# Altium schematic sheet 2_ADSTM32_MCU.SchDoc
size A4; SheetNumber: 3; SheetTotal: 4
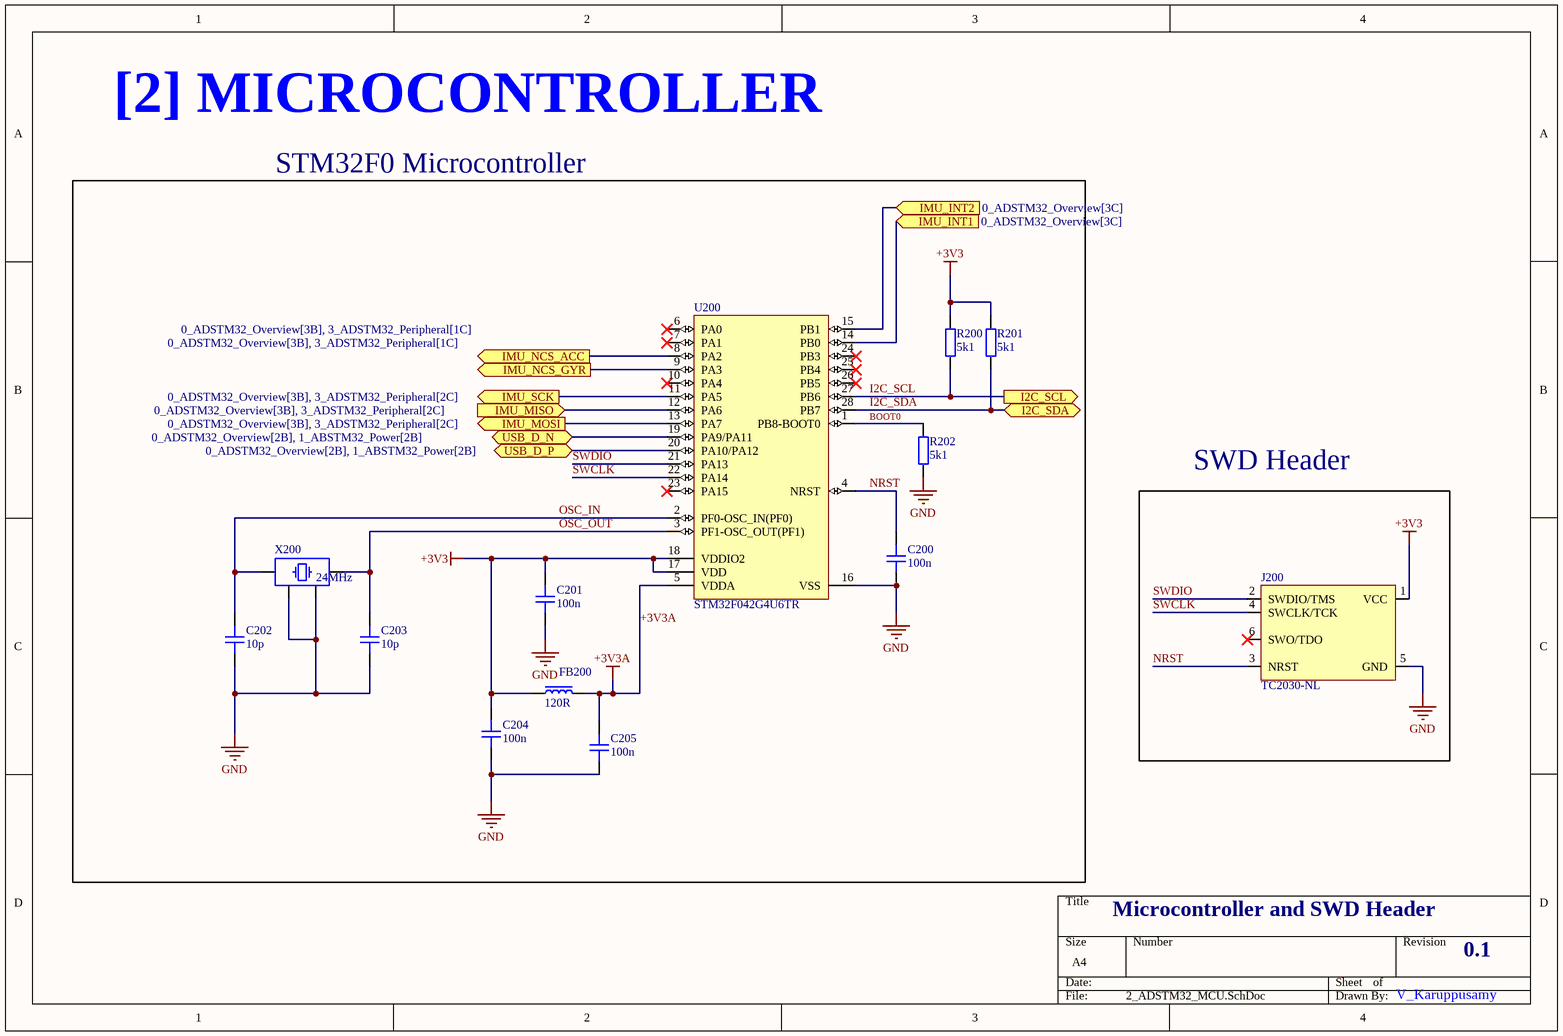
[diagram p0: 2_ADSTM32_MCU.SchDoc]

## Parts
C200  100n  [CAP_0805]
C201  100n  [CAP_0805]
C202  10p  [CAP_0805]
C203  10p  [CAP_0805]
C204  100n  [CAP_0805]
C205  100n  [CAP_0805]
FB200  120R  [FB_0402]
J200  TC2030-NL  [TC2030-NL-FP]  (no BOM)
R200  5k1  [RES_0603]
R201  5k1  [RES_0603]
R202  5k1  [RES_0603]
U200  STM32F042G4U6TR  [STM-UFQFPN28_V]
X200  24MHz  [XTAL_3225]

## Blocks framed on the sheet
STM32F0 Microcontroller: C200-C205 FB200 R200-R202 U200 X200
SWD Header: J200

## Ports
I2C_SCL (out), I2C_SDA (bidir), IMU_INT1 (in, see 0_ADSTM32_Overview[3C]), IMU_INT2 (in, see 0_ADSTM32_Overview[3C]), IMU_MISO (in, see 0_ADSTM32_Overview[3B], 3_ADSTM32_Peripheral[2C]), IMU_MOSI (out, see 0_ADSTM32_Overview[3B], 3_ADSTM32_Peripheral[2C]), IMU_NCS_ACC (out, see 0_ADSTM32_Overview[3B], 3_ADSTM32_Peripheral[1C]), IMU_NCS_GYR (out, see 0_ADSTM32_Overview[3B], 3_ADSTM32_Peripheral[1C]), IMU_SCK (out, see 0_ADSTM32_Overview[3B], 3_ADSTM32_Peripheral[2C]), USB_D_N (bidir, see 0_ADSTM32_Overview[2B], 1_ABSTM32_Power[2B]), USB_D_P (bidir, see 0_ADSTM32_Overview[2B], 1_ABSTM32_Power[2B])

## Nets
+3V3: C201.2 C204.2 FB200.1 J200.1(VCC) R200.2 R201.2 U200.17(VDD) U200.18(VDDIO2)
+3V3A: C205.2 FB200.2 U200.5(VDDA)
GND: C200.1 C201.1 C202.1 C203.1 C204.1 C205.1 J200.5(GND) R202.1 U200.16(VSS) X200.2 X200.4
BOOT0: R202.2 U200.1(PB8-BOOT0)
I2C_SCL: R200.1 U200.27(PB6) ; port I2C_SCL
I2C_SDA: R201.1 U200.28(PB7) ; port I2C_SDA
IMU_INT1: U200.14(PB0) ; port IMU_INT1
IMU_INT2: U200.15(PB1) ; port IMU_INT2
IMU_MISO: U200.12(PA6) ; port IMU_MISO
IMU_MOSI: U200.13(PA7) ; port IMU_MOSI
IMU_NCS_ACC: U200.8(PA2) ; port IMU_NCS_ACC
IMU_NCS_GYR: U200.9(PA3) ; port IMU_NCS_GYR
IMU_SCK: U200.11(PA5) ; port IMU_SCK
NRST: C200.2 J200.3(NRST) U200.4(NRST)
OSC_IN: C202.2 U200.2(PF0-OSC_IN(PF0)) X200.1
OSC_OUT: C203.2 U200.3(PF1-OSC_OUT(PF1)) X200.3
SWCLK: J200.4(SWCLK/TCK) U200.22(PA14)
SWDIO: J200.2(SWDIO/TMS) U200.21(PA13)
USB_D_N: U200.19(PA9/PA11) ; port USB_D_N
USB_D_P: U200.20(PA10/PA12) ; port USB_D_P

Not connected (* = marked no-connect by the designer): J200 6(SWO/TDO)*; U200 6(PA0)* 7(PA1)* 10(PA4)* 23(PA15)* 24(PB3)* 25(PB4)* 26(PB5)*

## Notes on the sheet
- [2] MICROCONTROLLER
- Microcontroller and SWD Header
- 0.1
- V_Karuppusamy

## Library data of the parts
C200-C205 = CAP_0805_16V: Capacitor SMD 0805 16V
FB200 = FB_0402: Ferrite Bead SMD 0402
J200 = TC2030-NL: Tag-Connect No-Solder SWD Debug Connector (No Legs) DO NOT PLACE; Manufacturer: Tag-Connect; Manufacturer Part Number: TC2030-NL-FP
R200-R202 = RES_0603: Resistor SMD 0603; Manufacturer: *; Manufacturer Part Number: *; Distributor Link: *
U200 = CMP-0304-00110-4: ARM Cortex-M0 32-bit MCU, 16 KB Flash, 6 KB Internal RAM, 24 I/Os, 28-Pin UFQFPN, -40 to 85 degC, Tape and Reel; Manufacturer: STMicroelectronics; Internal RAM Size (kB): 6; Supply Voltage(Vcc) min (V): 2; I/Os (High Current): 24; Operating Frequency(F) (Processor speed) (MHz): 48; FLASH Size (Prog) (kB): 16; PartNumber: STM32F042G4U6TR; Package Reference: UFQFPN28; Package Description: 28-Pin Ultra Thin Fine Pitch Quad Flat No-Lead, 4 x 4 x 0.6 mm Body, 0.5 mm Pitch; ComponentLink1Description: Manufacturer URL; Packing: Tape and Reel; Core: ARM Cortex-M0; ComponentLink1URL: http://www.st.com/; DatasheetVersion: Rev. 5; ComponentLink2URL: http://www.st.com/st-web-ui/static/active/en/resource/technical/document/datasheet/DM00105814.pdf; Mounting Technology: Surface Mount; ComponentLink2Description: Datasheet
X200 = TSX-3225_24.0000MF15X-AC: Crystal SMD 24MHz 10PPM 7pF 3225; Manufacturer: Epson; Manufacturer Number: TSX-3225 24.0000MF15X-AC; ESR: 40R; Value: 24MHz; Type: XTAL; Load Capacitance: 7pF